# Altium schematic sheet PicoInterface.SchDoc
size 297 x 209 mm; SheetNumber: 1; SheetTotal: 3; swcgroup: FabLab; Org: Sainsbury Wellcome Centre; Add1: 25 Howland Street; Add2: London; Add3: W1T 4JG; WebAddress: www.sainsburywellcome.org; SheetSize: A4; SheetName: Pi Pico Interface
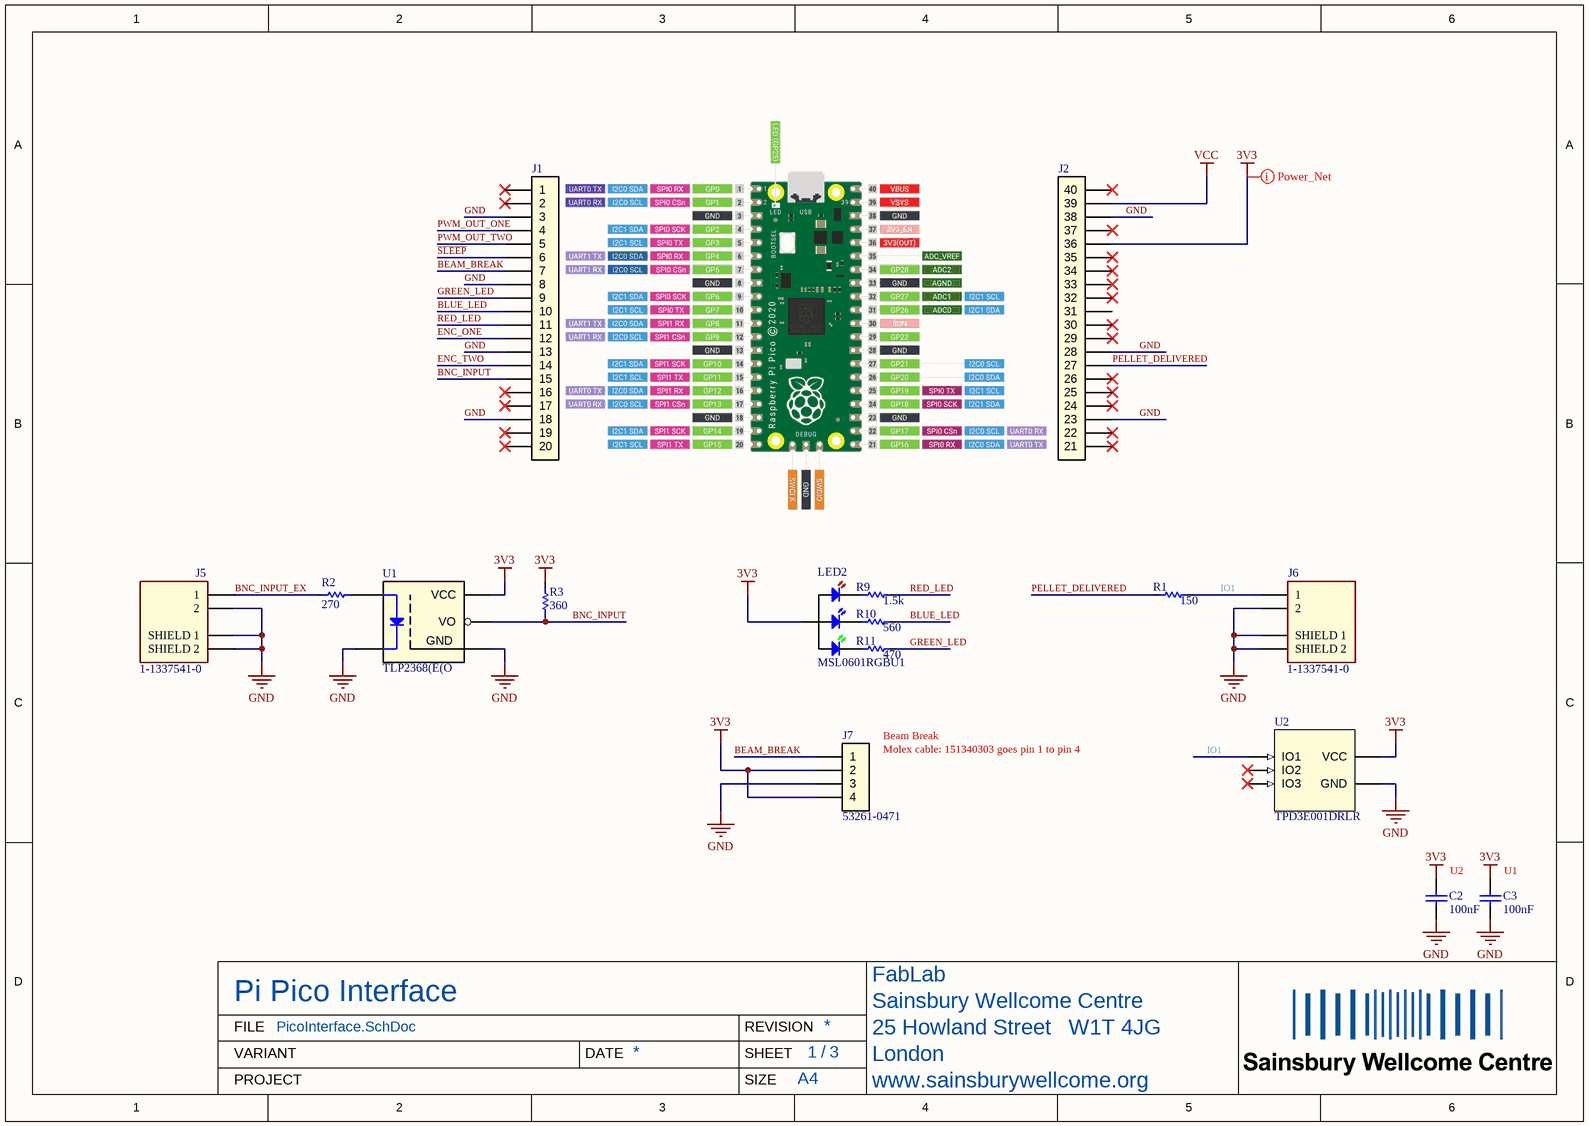
[diagram p0: PicoInterface.SchDoc]

## Parts
C2  value 100nF  [FP-GRM188-0_1-e0_2_0_5-IPC_B]  (hidden comment: C0603-100nF-100V-10%-X7R)
C3  value 100nF  [FP-GRM188-0_1-e0_2_0_5-IPC_B]  (hidden comment: C0603-100nF-100V-10%-X7R)
J1  SSW-120-01-x-S  [SAMTEC_SSW-120-01-G-S]  (value not drawn)
J2  SSW-120-01-x-S - 21-40  [SAMTEC_SSW-120-01-G-S - 21-40]  (value not drawn)
J5  1-1337541-0  [TE- 1-1337541-0]
J6  1-1337541-0  [TE- 1-1337541-0]
J7  53261-0471  [MOLEX_53261-0471]
LED2  MSL0601RGBU1  [LED_MSL06_ROM]
R1  value 150  [FP-CPF0603-IPC_B]  (hidden comment: R0603-150R-1/16W-0.1%)
R2  value 270  [FP-CPF0603-IPC_B]  (hidden comment: R0603-270R-1/16W-0.1%)
R3  value 360  [FP-CPF0603-IPC_B]  (hidden comment: R0603-360R-1/16W-0.1%)
R9  value 1.5k  [FP-CPF0603-IPC_B]  (hidden comment: R0603-1k5-1/16W-0.1%)
R10  value 560  [FP-CPF0603-IPC_B]  (hidden comment: R0603-560R-1/16W-0.1%)
R11  value 470  [FP-CPF0603-IPC_B]  (hidden comment: R0603-470R-1/16W-0.1%)
U1  PartNumber: TLP2368(E(O  [5pin SO6_TOS]  (hidden comment: TLP2368)
U2  TPD3E001DRLR  [DRL5_TEX]

## Nets
3V3: C2.2 C3.2 J2.36 J7.2 J7.4 LED2.1 R3.2 U1.6(VCC) U2.5(VCC)
GND: C2.1 C3.1 J1.3 J1.8 J1.13 J1.18 J2.23 J2.28 J2.38 J5.2 J5.SH1(SHIELD_1) J5.SH2(SHIELD_2) J6.2 J6.SH1(SHIELD_1) J6.SH2(SHIELD_2) J7.3 U1.3(CATHODE) U1.4(GND) U2.3(GND)
VCC: J2.39
~{SLEEP}: J1.6
BEAM_BREAK: J1.7 J7.1
BLUE_LED: J1.10 R10.2
BNC_INPUT: J1.15 R3.1 U1.5(VO)
BNC_INPUT_EX: J5.1 R2.1
ENC_ONE: J1.12
ENC_TWO: J1.14
GREEN_LED: J1.9 R11.2
IO1: J6.1 R1.2 U2.1(IO1)
PELLET_DELIVERED: J2.27 R1.1
PWM_OUT_ONE: J1.4
PWM_OUT_TWO: J1.5
RED_LED: J1.11 R9.2
NetLED2_2: LED2.2 R11.1
NetLED2_3: LED2.3 R10.1
NetLED2_4: LED2.4 R9.1
NetR2_2: R2.2 U1.1(ANODE)

Not connected (* = marked no-connect by the designer): J1 1* 2* 16* 17* 19* 20*; J2 21* 22* 24* 25* 26* 29* 30* 31 32* 33* 34* 35* 37* 40*; U2 2(IO2)* 4(IO3)*

## Layout directives
net class Power Nets: 3V3

## Notes on the sheet
- (near J7) Beam Break
- (near J7) Molex cable: 151340303 goes pin 1 to pin 4
- U2
- (near C3) U1
- FILE
- VARIANT
- DATE
- REVISION
- SHEET
- /
- PROJECT
- SIZE

## Library data of the parts
C2 C3 = CMP-611-0027-15: 0.1µF ±10% 100V Ceramic Capacitor X7R 0603 (1608 Metric); Pick&PlaceFootprint: 0603_CAP; Dielectric: X7R; REACH SVHC: No SVHC; Case Code (Metric): 1608; Series: GRM; Case/Package: 0603; Capacitance: 100nF; RoHS Compliant: Yes; Radiation Hardening: No; Case Code (Imperial): 0603; Min Operating Temperature: -55°C; Capacitor Type: Ceramic; Voltage Rating: 100V; Construction: Flat; Lead Free: Lead Free; Size: 0.8mm; Packaging: Tape and Reel; Voltage Rating (DC): 100V; Voltage: 100V; Width: 0.8mm; Max Operating Temperature: 125°C; RoHS: Yes; Material: Ceramic; Depth: 0.8mm; Thickness: 0.035inch; Termination: SMD/SMT; Weight: 0.000222oz; Length: 1.6mm; Mount: Surface Mount; Height: 0.8mm; Package Quantity: 1; Tolerance: 10%
J1 = CMP-310-0034-2: Conn Socket Strip SKT 20 POS 2.54mm Solder ST Thru-Hole; Gender: Female; Number of Contacts: 20; Mating Cycles: 100; Number of Rows: 1; Color: Black; RoHS Compliant: Yes; Contact Plating: Gold; Pitch: 2.54mm; Termination: Solder; Contact Material: Bronze; Mount: Through Hole
J2 = CMP-310-0035-1: Conn Socket Strip SKT 20 POS 2.54mm Solder ST Thru-Hole (pins 21 - 40); Gender: Female; Mating Cycles: 100; Number of Contacts: 20; Contact Material: Bronze; RoHS Compliant: Yes; Number of Rows: 1; Contact Plating: Gold; Mount: Through Hole; Pitch: 2.54mm; Termination: Solder; Color: Black
J5 J6 = CMP-730-0000-5: TE CONNECTIVITY / GREENPAR         1-1337541-0            RF / Coaxial Connector, BNC Coaxial, Straight Jack, Solder, 50 ohm, Brass; PCB Mounting Orientation: Vertical; Body Plating: Nickel; Number of Positions: 1; Connector Type: BNC, Jack; Sealable: No (Without); Polarity: Normal; PCB Mount Retention: With; Insulation Resistance: 5GR; Max Frequency: 4GHz; Tail Length: 5.8mm; Gender: Female; PCB Thickness: 0.126inch; Body Material: Zinc; Dielectric Material: PE; Impedance: 50R; Max Operating Temperature: 85°C; Length: 14.76mm; Min Operating Temperature: -55°C; Radiation Hardening: No; Insulation Material: Polybutylene; Mount: Panel; Fastening Type: Bayonet; Packaging: Box; Housing Material: Polyester; Housing Colour: White; Contact Material: Brass; Frequency: 4GHz; ELV: Compliant; Colour: White; Plating: Nickel; PartNumber: 1-1337541-0; Contact Plating: Gold; REACH SVHC: Unknown; Termination: Solder; Orientation: Straight; Package Quantity: 100; Depth: 15.8mm
J7 = CMP-370-0017-6: MOLEX 1.25mm (.049") Pitch PicoBlade Header, Surface Mount, Right Angle, Lead-free, 4 Circuits; Gender: Male; Voltage Rating: 125V; Number of Positions: 4; Contact Resistance: 20mR; Insulation Resistance: 100MR; Current Rating: 1A; Glow Wire Compliant: Non-compliant; Orientation: Right Angle; Package Quantity: 1000; Color: Beige; Voltage Rating (DC): 125V; Series: 53261; Lead Free: Lead Free; Contact Plating: Tin; Housing Color: Natural; Contact Gender: Male; Contact Material: Tin; Number of Rows: 1; Mount: Surface Mount; Housing Material: Thermoplastic; Lead Pitch: 1.25mm; Working Voltage: 125V; Flammability Rating: UL94 V-0; Packaging: Cut Tape; Termination: SMD/SMT; Pitch: 1.25mm; Radiation Hardening: No; Min Operating Temperature: -40°C; Case/Package: 53261-0471; Voltage Rating (AC): 125V; Number of Circuits: 4; Contact Type: -; Max Operating Temperature: 105°C; Number of Contacts: 4; REACH SVHC: Unknown; Weight: 0.005598oz
LED2 = CMP-520-0010-2: Triple Color LED, Red/green/blue, Milky White; Pick&PlaceFootprint: MSL06; Mount: Surface Mount; PartNumber: MSL0601RGBU1
R1 = CMP-633-0078-2: Surface Mount Resistor 150 Ohm 1/16 W 0.1% 0603 (1608 Metric); Number of Resistors: 1; Pick&PlaceFootprint: R0603; Temperature Coefficient: 25ppm/°C; Power Rating: 62.5mW; Voltage Rating: 50V; Max Power Dissipation: 62.5 mW; Max Operating Temperature: 155°C; Series: CPF; RoHS: Yes; Case Code (Metric): 1608; Width: 0.8mm; Construction: Chip; Length: 1.6mm; Composition: Thin Film; Min Operating Temperature: -55°C; REACH SVHC: Yes; RoHS Compliant: Yes; Height: 0.45mm; Termination: Wraparound; Packaging: Tape and Reel; Resistance: 150; Size Code: 0603; Technology: THIN FILM; ELV: Compliant; Weight: 7.1E-05oz; Tolerance: 0.1%; Number of Pins: 2; Resistance Tolerance: 0.1%; Resistor Type: FIXED RESISTOR; Mount: Surface Mount; Number of Terminations: 2; Case Code (Imperial): 0603; Voltage Rating (DC): 50V; Case/Package: 0603
R2 = CMP-633-0083-1: Surface Mount Resistor 270 Ohm 1/16 W 0.1% 0603 (1608 Metric); Voltage Rating: 50V; Number of Resistors: 1; Max Power Dissipation: 62.5 mW; Pick&PlaceFootprint: R0603; Power Rating: 62.5mW; Temperature Coefficient: 25ppm/°C; Voltage Rating (DC): 50V; Weight: 7.1E-05oz; RoHS: Yes; REACH SVHC: Yes; Size Code: 0603; Mount: Surface Mount; Tolerance: 0.1%; Composition: Thin Film; Length: 1.6mm; Number of Pins: 2; Min Operating Temperature: -55°C; Width: 0.8mm; Technology: THIN FILM; Max Operating Temperature: 155°C; Resistor Type: FIXED RESISTOR; Number of Terminations: 2; Case Code (Imperial): 0603; Packaging: Tape and Reel; Construction: Chip; Case Code (Metric): 1608; Case/Package: 0603; Series: CPF; RoHS Compliant: Yes; Termination: Wraparound; Resistance: 270; ELV: Compliant; Height: 0.45mm; Resistance Tolerance: 0.1%
R3 = CMP-633-0019-16: Surface Mount Resistor 360 Ohm 1/16 W 0.1% 0603 (1608 Metric); Pick&PlaceFootprint: R0603; Voltage Rating: 50V; Number of Resistors: 1; Temperature Coefficient: 25ppm/°C; Power Rating: 62.5mW; Max Power Dissipation: 62.5 mW; REACH SVHC: No SVHC; Tolerance: 0.1%; Case Code (Metric): 1608; Weight: 7.1E-05oz; Resistance Tolerance: 0.1%; Resistor Type: Thin Film; Series: CPF; RoHS: Yes; Case/Package: 0603; Voltage Rating (DC): 50V; Length: 1.6mm; Max Operating Temperature: 155°C; Technology: Thin Film; Min Operating Temperature: -55°C; Packaging: Tape and Reel; Size Code: 0603; ELV: Compliant; Number of Terminations: 2; Resistance: 360; Height: 0.45mm; Case Code (Imperial): 0603; Number of Pins: 2; Composition: Thin Film; Mount: Surface Mount; RoHS Compliant: Yes; Termination: Solder; Width: 0.8mm
R9 = CMP-633-0029-14: Surface Mount Resistor 1k5 Ohm 1/16 W 0.1% 0603 (1608 Metric); Number of Resistors: 1; Power Rating: 62.5mW; Max Power Dissipation: 62.5 mW; Voltage Rating: 50V; Pick&PlaceFootprint: R0603; Temperature Coefficient: 25ppm/°C; Length: 1.6mm; Resistance: 1.5k; Case Code (Metric): 1608; Max Operating Temperature: 155°C; Technology: Thin Film; Height: 0.45mm; Resistor Type: Thin Film; Case Code (Imperial): 0603; Case/Package: 0603; Number of Terminations: 2; Min Operating Temperature: -55°C; REACH SVHC: No SVHC; Width: 0.8mm; RoHS Compliant: Yes; ELV: Compliant; Size Code: 0603; RoHS: Yes; Packaging: Tape and Reel; Tolerance: 0.1%; Mount: Surface Mount; Composition: Thin Film; Voltage Rating (DC): 50V; Weight: 7.1E-05oz; Termination: Solder; Number of Pins: 2; Resistance Tolerance: 0.1%; Series: CPF
R10 = CMP-633-0030-9: Surface Mount Resistor 560 Ohm 1/16 W 0.1% 0603 (1608 Metric); Number of Resistors: 1; Voltage Rating (DC): 50V; Temperature Coefficient: 25ppm/°C; Pick&PlaceFootprint: R0603; Power Rating: 62.5mW; Max Power Dissipation: 62.5 mW; ELV: Compliant; Technology: Thin Film; Resistor Type: Thin Film; Series: CPF; Number of Terminations: 2; Case Code (Metric): 1608; Resistance: 560; Case/Package: 0603; Width: 0.8mm; Max Operating Temperature: 155°C; Length: 1.6mm; RoHS Compliant: Yes; Termination: Solder; Voltage Rating: 50V; Min Operating Temperature: -55°C; Height: 0.45mm; Weight: 7.1E-05oz; Case Code (Imperial): 0603; Size Code: 0603; Mount: Surface Mount; REACH SVHC: No SVHC; RoHS: Yes; Composition: Thin Film; Packaging: Tape and Reel; Tolerance: 0.1%; Number of Pins: 2; Resistance Tolerance: 0.1%
R11 = CMP-633-0020-13: Surface Mount Resistor 470 Ohm 1/16 W 0.1% 0603 (1608 Metric); Power Rating: 62.5mW; Max Power Dissipation: 62.5 mW; Pick&PlaceFootprint: R0603; Temperature Coefficient: 25ppm/°C; Voltage Rating: 50V; Number of Resistors: 1; ELV: Compliant; Series: CPF; Mount: Surface Mount; Weight: 7.1E-05oz; Resistance Tolerance: 0.1%; Width: 0.8mm; REACH SVHC: No SVHC; Length: 1.6mm; Termination: Solder; Number of Pins: 2; Size Code: 0603; Case Code (Imperial): 0603; RoHS Compliant: Yes; Max Operating Temperature: 155°C; Packaging: Tape and Reel; Tolerance: 0.1%; Resistance: 470; Min Operating Temperature: -55°C; Resistor Type: Thin Film; Case Code (Metric): 1608; Number of Terminations: 2; Technology: Thin Film; Case/Package: 0603; Composition: Thin Film; Voltage Rating (DC): 50V; Height: 0.45mm; RoHS: Yes
U1 = CMP-530-0000-11: TOSHIBA         TLP2368(E(O             Digital Output Optocoupler, Open Collector, 1 Channel, SOIC, 5 Pins, 3.75 kV, 20 Mbaud; Forward Voltage: 1.7V; Reverse Breakdown Voltage: 5V; Output Current: 25mA; Direction: Unidirectional; Power Dissipation: 60mW; Pick&PlaceFootprint: SO6; Propagation Delay: 60ns; Number of Elements: 1; Input Current: 14mA; Isolation Voltage: 3.75kV; Packaging: Tape and Reel; Min Operating Temperature: -40°C; Mount: Surface Mount; Case/Package: SO; Max Operating Temperature: 125°C; Radiation Hardening: No; Forward Current: 25mA; Number of Channels: 1; Number of Pins: 5; REACH SVHC: No SVHC
U2 = CMP-820-0000-4: Low-Capacitance 3-Channel +/-15KV ESD-Protection Array for High-Speed Data Interfaces 5-SOT-5X3; Pick&PlaceFootprint: DRL-5; Mount: Surface Mount; PartNumber: TPD3E001DRLR